# EAGLE design Doorbell (EAGLE 7.2.0)
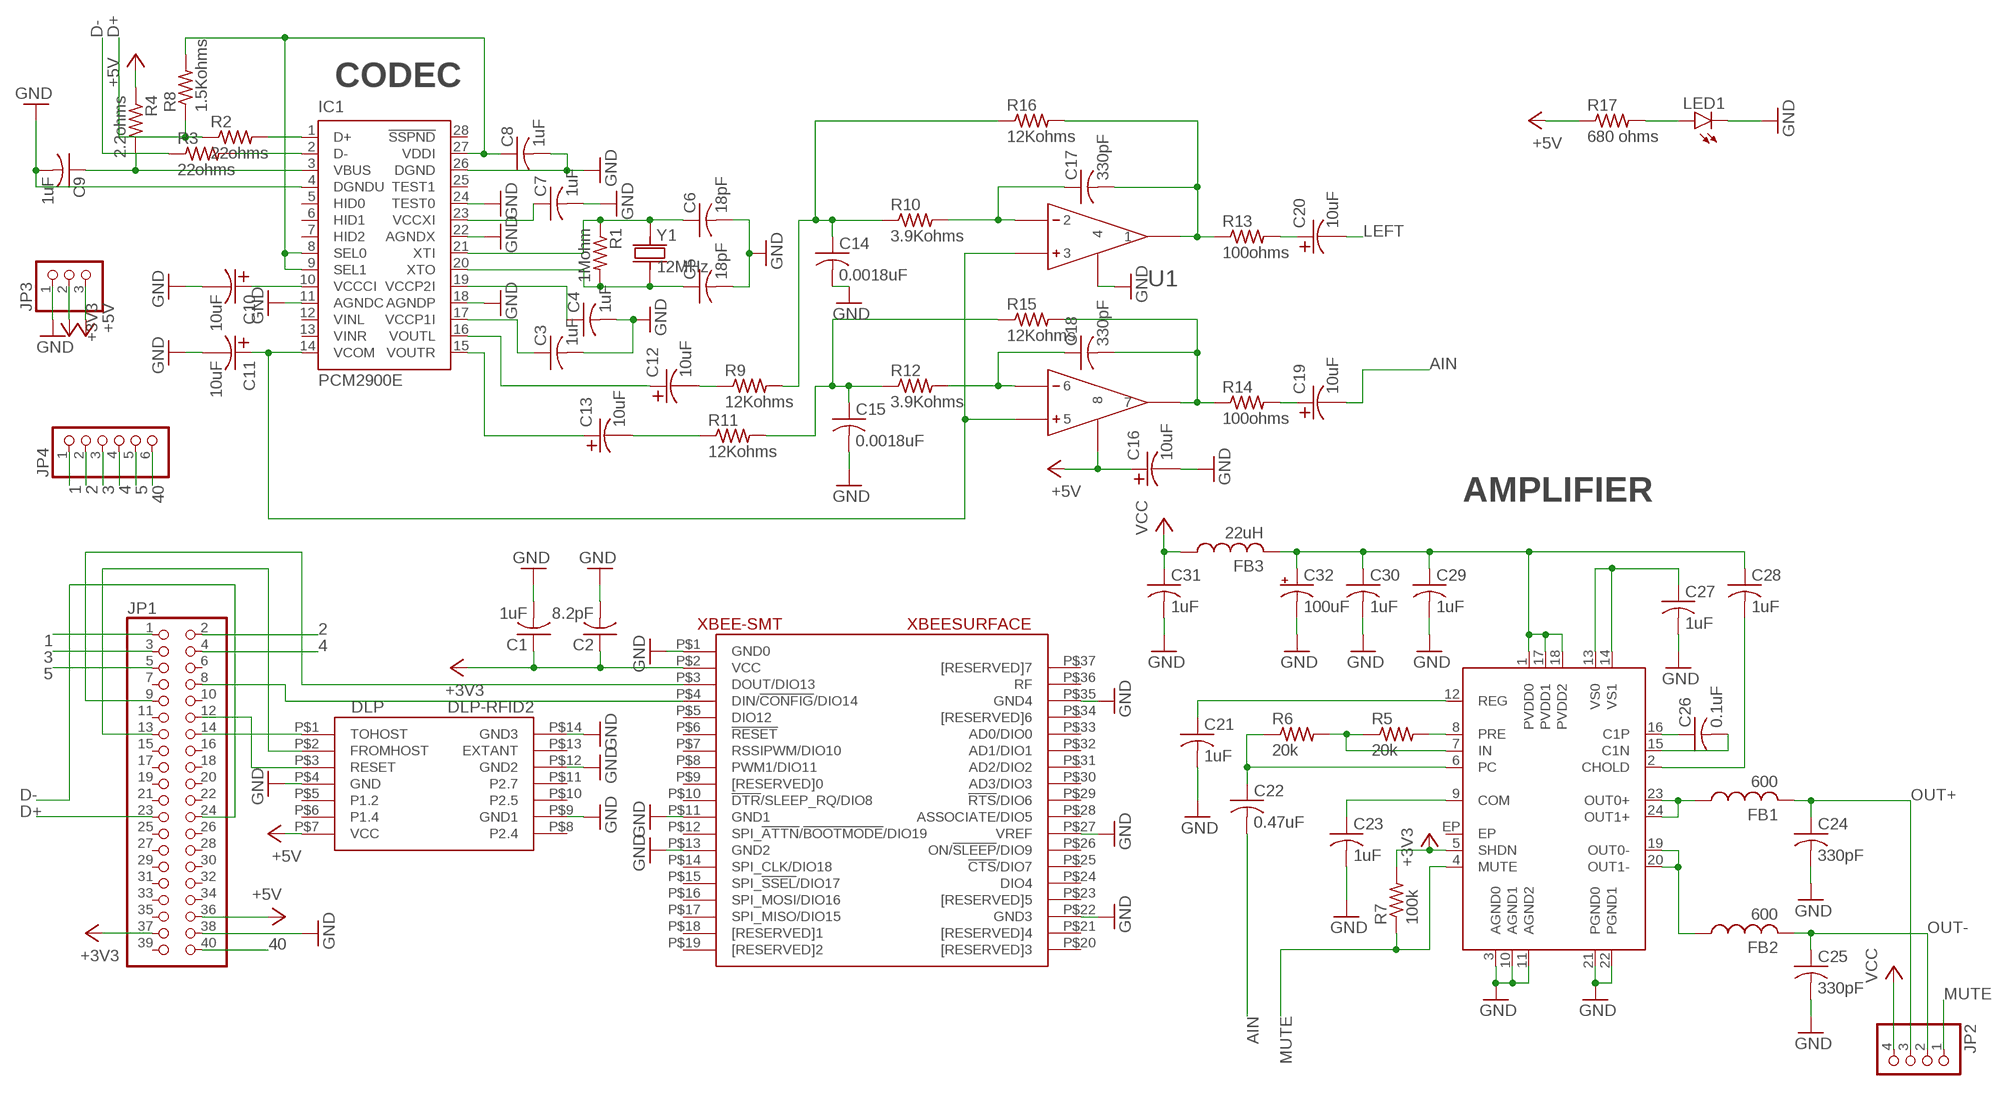
[diagram p0: schematic, sheet 1]

## Parts
C1  1uF  CAP0603  [0603_CAP]
C2  8.2pF  CAP0603  [0603_CAP]
C3  1uF  CAP0603  [0603_CAP]
C4  1uF  CAP0603  [0603_CAP]
C5  18pF  CAP0603  [0603_CAP]
C6  18pF  CAP0603  [0603_CAP]
C7  1uF  CAP0603  [0603_CAP]
C8  1uF  CAP0603  [0603_CAP]
C9  1uF  CAP0603  [0603_CAP]
C10  10uF  CAP-TANT  [1411_CAP]
C11  10uF  CAP-TANT  [1411_CAP]
C12  10uF  CAP-TANT  [1411_CAP]
C13  10uF  CAP-TANT  [1411_CAP]
C14  0.0018uF  CAP0603  [0603_CAP]
C15  0.0018uF  CAP0603  [0603_CAP]
C16  10uF  CAP-TANT  [1411_CAP]
C17  330pF  CAP0603  [0603_CAP]
C18  330pF  CAP0603  [0603_CAP]
C19  10uF  CAP-TANT  [1411_CAP]
C20  10uF  CAP-TANT  [1411_CAP]
C21  1uF  CAP0603  [0603_CAP]
C22  0.47uF  CAP0603  [0603_CAP]
C23  1uF  CAP0603  [0603_CAP]
C24  330pF  CAP0603  [0603_CAP]
C25  330pF  CAP0603  [0603_CAP]
C26  0.1uF  CAP0603  [0603_CAP]
C27  1uF  CAP0603  [0603_CAP]
C28  1uF  CAP0603  [0603_CAP]
C29  1uF  CAP0603  [0603_CAP]
C30  1uF  CAP0603  [0603_CAP]
C31  1uF  CAP0603  [0603_CAP]
C32  100uF  CAP_POLF  [F_CAP]
DLP  DLP-RFID2  [DLP-RFID2]
FB1  600  FB0805  [0805_FB]
FB2  600  FB0805  [0805_FB]
FB3  22uH  FB0805  [0805_FB]
IC1  PCM2900E  [SSOP28DB]
IC2  MAX9737  [TQFN24]
JP1  PINHD-2X20  [2X20]
JP2  PINHD-1X4  [1X04]
JP3  PINHD-1X3  [1X03]
JP4  PINHD-1X6  [1X06]
LED1  LED0603  [0603_LED]
R1  1Mohm  RESISTOR0603  [0603_RESISTOR]
R2  22ohms  RESISTOR0603  [0603_RESISTOR]
R3  22ohms  RESISTOR0603  [0603_RESISTOR]
R4  2.2ohms  RESISTOR0603  [0603_RESISTOR]
R5  20k  RESISTOR0603  [0603_RESISTOR]
R6  20k  RESISTOR0603  [0603_RESISTOR]
R7  100k  RESISTOR0603  [0603_RESISTOR]
R8  1.5Kohms  RESISTOR0603  [0603_RESISTOR]
R9  12Kohms  RESISTOR0603  [0603_RESISTOR]
R10  3.9Kohms  RESISTOR0603  [0603_RESISTOR]
R11  12Kohms  RESISTOR0603  [0603_RESISTOR]
R12  3.9Kohms  RESISTOR0603  [0603_RESISTOR]
R13  100ohms  RESISTOR0603  [0603_RESISTOR]
R14  100ohms  RESISTOR0603  [0603_RESISTOR]
R15  12Kohms  RESISTOR0603  [0603_RESISTOR]
R16  12Kohms  RESISTOR0603  [0603_RESISTOR]
R17  680 ohms  RESISTOR0603  [0603_RESISTOR]
U1  OP-AMP  [OPA2353UA]
XBEE-SMT  XBEESURFACE  [XBEESURFACE]
Y1  12MHz  CRYSTAL5X3  [CRYSTAL_5X3]

## Nets
1: JP1.1 JP4.1
2: JP1.2 JP4.2
3: JP1.3 JP4.3
4: JP1.4 JP4.4
5: JP1.5 JP4.5
40: JP1.40 JP4.6
+3V3: C1.1 C2.1 IC2.5(SHDN) JP1.37 JP3.2 R7.2 XBEE-SMT.P$2(VCC)
+5V: C16.P$1 DLP.P$7(VCC) JP1.36 JP3.3 R4.1 R17.1 U1.P$8
AIN: C19.P$2 C22.2
D+: JP1.23 R2.1 R8.1
D-: JP1.24 R3.1
GND: C1.2 C2.2 C3.2 C4.2 C5.2 C6.2 C7.2 C8.2 C9.2 C10.P$2 C11.P$2 C14.2 C15.2 C16.P$2 C21.2 C23.2 C24.2 C25.2 C27.2 C29.2 C30.2 C31.2 C32.- DLP.P$4(GND) DLP.P$9(GND1) DLP.P$12(GND2) DLP.P$14(GND3) IC1.4(DGNDU) IC1.11(AGNDC) IC1.18(AGNDP) IC1.22(AGNDX) IC1.24(TEST0) IC1.26(DGND) IC2.3(AGND0) IC2.10(AGND1) IC2.11(AGND2) IC2.21(PGND0) IC2.22(PGND1) JP1.38 JP3.1 LED1.C U1.P$4 XBEE-SMT.P$1(GND0) XBEE-SMT.P$11(GND1) XBEE-SMT.P$13(GND2) XBEE-SMT.P$22(GND3) XBEE-SMT.P$27(VREF) XBEE-SMT.P$35(GND4)
LEFT: C20.P$2
MUTE: IC2.4(MUTE) JP2.1 R7.1
N$1: DLP.P$1(TOHOST) JP1.14
N$2: IC2.8(PRE) R5.2
N$3: IC2.7(IN) R5.1 R6.2
N$4: DLP.P$3(RESET) JP1.12
N$5: DLP.P$2(FROMHOST) JP1.13
N$6: JP1.8 XBEE-SMT.P$4(DIN/!CONFIG!/DIO14)
N$7: JP1.9 XBEE-SMT.P$3(DOUT/DIO13)
N$8: C3.1 IC1.17(VCCP1I)
N$9: IC1.1(D+) R2.2
N$10: C22.1 IC2.6(PC) R6.1
N$11: C8.1 IC1.8(SEL0) IC1.9(SEL1) IC1.27(VDDI) R8.2
N$12: IC1.2(D-) R3.2
N$13: C21.1 IC2.12(REG)
N$15: C7.1 IC1.23(VCCXI)
N$16: C6.1 IC1.21(XTI) R1.1 Y1.1
N$17: C5.1 IC1.20(XTO) R1.2 Y1.2
N$18: C4.1 IC1.19(VCCP2I)
N$19: C12.P$2 R9.1
N$20: C13.P$2 R11.1
N$21: C17.1 R10.2 U1.P$2
N$22: C10.P$1 IC1.10(VCCCI)
N$23: C11.P$1 IC1.14(VCOM) U1.P$3 U1.P$5
N$24: C18.1 R12.2 U1.P$6
N$25: C12.P$1 IC1.16(VOUTL)
N$26: C13.P$1 IC1.15(VOUTR)
N$27: C14.1 R9.2 R10.1 R16.1
N$28: C15.1 R11.2 R12.1 R15.1
N$29: C17.2 R13.1 R16.2 U1.P$1
N$30: C18.2 R14.1 R15.2 U1.P$7
N$31: LED1.A R17.2
N$33: C20.P$1 R13.2
N$34: C19.P$1 R14.2
N$35: C9.1 IC1.3(VBUS) R4.2
N$37: C23.1 IC2.9(COM)
N$42: FB1.1 IC2.23(OUT0+) IC2.24(OUT1+)
N$44: FB2.1 IC2.19(OUT0-) IC2.20(OUT1-)
N$48: C26.1 IC2.16(C1P)
N$49: C26.2 IC2.15(C1N)
N$50: C28.2 IC2.2(CHOLD)
N$51: C28.1 C29.1 C30.1 C32.+ FB3.2 IC2.1(PVDD0) IC2.17(PVDD1) IC2.18(PVDD2)
N$52: C27.1 IC2.13(VS0) IC2.14(VS1)
OUT+: C24.1 FB1.2 JP2.3
OUT-: C25.1 FB2.2 JP2.2
VCC: C31.1 FB3.1 JP2.4
Unconnected: DLP.P$5(P1.2) DLP.P$6(P1.4) DLP.P$8(P2.4) DLP.P$10(P2.5) DLP.P$11(P2.7) DLP.P$13(EXTANT) IC1.5(HID0) IC1.6(HID1) IC1.7(HID2) IC1.12(VINL) IC1.13(VINR) IC1.25(TEST1) IC1.28(!SSPND) IC2.EP JP1.6 JP1.7 JP1.10 JP1.11 JP1.15 JP1.16 JP1.17 JP1.18 JP1.19 JP1.20 JP1.21 JP1.22 JP1.25 JP1.26 JP1.27 JP1.28 JP1.29 JP1.30 JP1.31 JP1.32 JP1.33 JP1.34 JP1.35 JP1.39 XBEE-SMT.P$5(DIO12) XBEE-SMT.P$6(!RESET!) XBEE-SMT.P$7(RSSIPWM/DIO10) XBEE-SMT.P$8(PWM1/DIO11) XBEE-SMT.P$9([RESERVED]0) XBEE-SMT.P$10(!DTR!/SLEEP_RQ/DIO8) XBEE-SMT.P$12(SPI_!ATTN!/!BOOTMODE!/DIO19) XBEE-SMT.P$14(SPI_CLK/DIO18) XBEE-SMT.P$15(SPI_!SSEL!/DIO17) XBEE-SMT.P$16(SPI_MOSI/DIO16) XBEE-SMT.P$17(SPI_MISO/DIO15) XBEE-SMT.P$18([RESERVED]1) XBEE-SMT.P$19([RESERVED]2) XBEE-SMT.P$20([RESERVED]3) XBEE-SMT.P$21([RESERVED]4) XBEE-SMT.P$23([RESERVED]5) XBEE-SMT.P$24(DIO4) XBEE-SMT.P$25(!CTS!/DIO7) XBEE-SMT.P$26(ON/!SLEEP!/DIO9) XBEE-SMT.P$28(ASSOCIATE/DIO5) XBEE-SMT.P$29(!RTS!/DIO6) XBEE-SMT.P$30(AD3/DIO3) XBEE-SMT.P$31(AD2/DIO2) XBEE-SMT.P$32(AD1/DIO1) XBEE-SMT.P$33(AD0/DIO0) XBEE-SMT.P$34([RESERVED]6) XBEE-SMT.P$36(RF) XBEE-SMT.P$37([RESERVED]7)

## Notes on the sheet
- CODEC
- AMPLIFIER

## Library data of the parts
C1-C9 C14 C15 C17 C18 C21-C31 = jkf:CAP
C10-C13 C16 C19 C20 = 1parts:CAP-TANT
C32 = jkf:CAP_POL
DLP = 1parts:DLP-RFID2
FB1-FB3 = jkf:FB
IC1 = texas:PCM29*: STEREO AUDIO CODEC WITH USB INTERFACE SINGLE-ENDED ANALOG INPUT/OUTPUT AND S/PDIF; MF: TEXAS INSTRUMENTS; MPN: PCM2900E; OC_FARNELL: 1207086; OC_NEWARK: 75C5376
IC2 = jkf:MAX9737; DIGIKEY#: MAX9737ETG+TCT-ND; MANF: Maxim; MANF#: MAX9737ETG+T
JP1 = pinhead:PINHD-2X20: PIN HEADER
JP2 = pinhead:PINHD-1X4: PIN HEADER
JP3 = pinhead:PINHD-1X3: PIN HEADER
JP4 = pinhead:PINHD-1X6: PIN HEADER
LED1 = jkf:LED; DIGIKEY#: 516-2493-1-ND; MANF: Avago Technologies; MANF#: HSMG-C191
R1-R17 = jkf:RESISTOR
U1 = 1parts:OP-AMP: Datasheet: http://www.ti.com/lit/ds/symlink/opa2353.pdf; DIGI-KEY: 296-26259-1-ND
XBEE-SMT = 1parts:XBEESURFACE: Data Sheet: http://ftp1.digi.com/support/documentation/90002002_P.pdf
Y1 = jkf:CRYSTAL

## Board
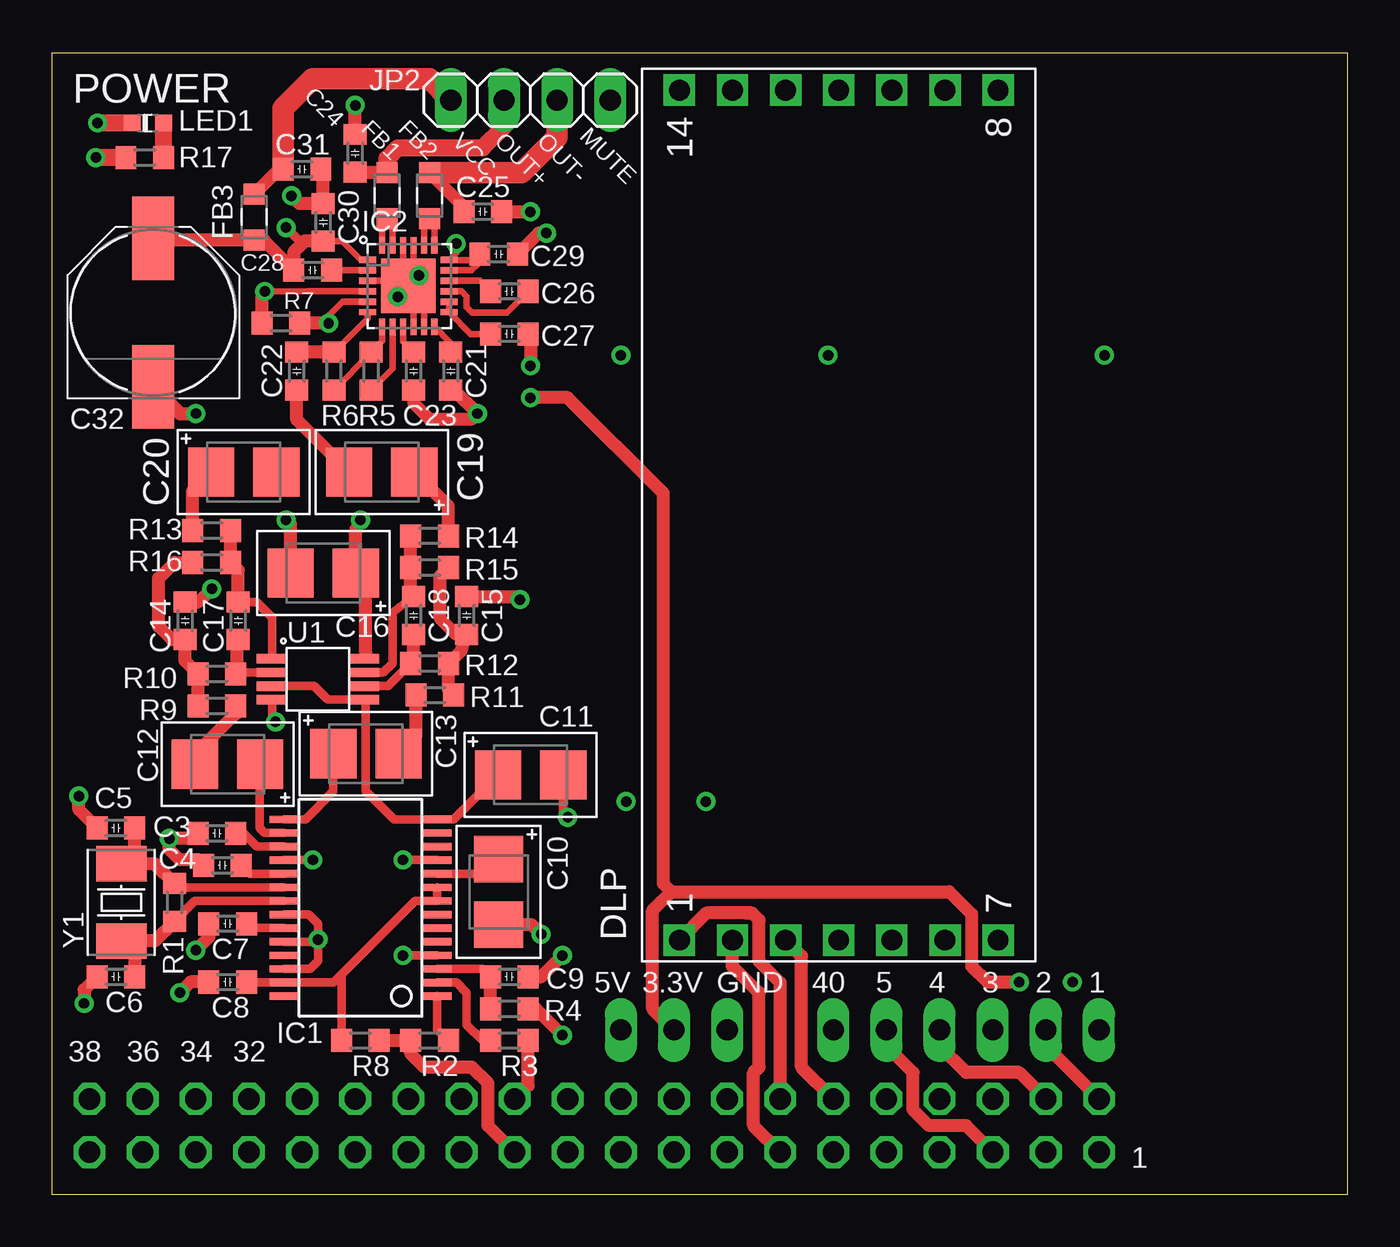
[diagram p1: board, top side]
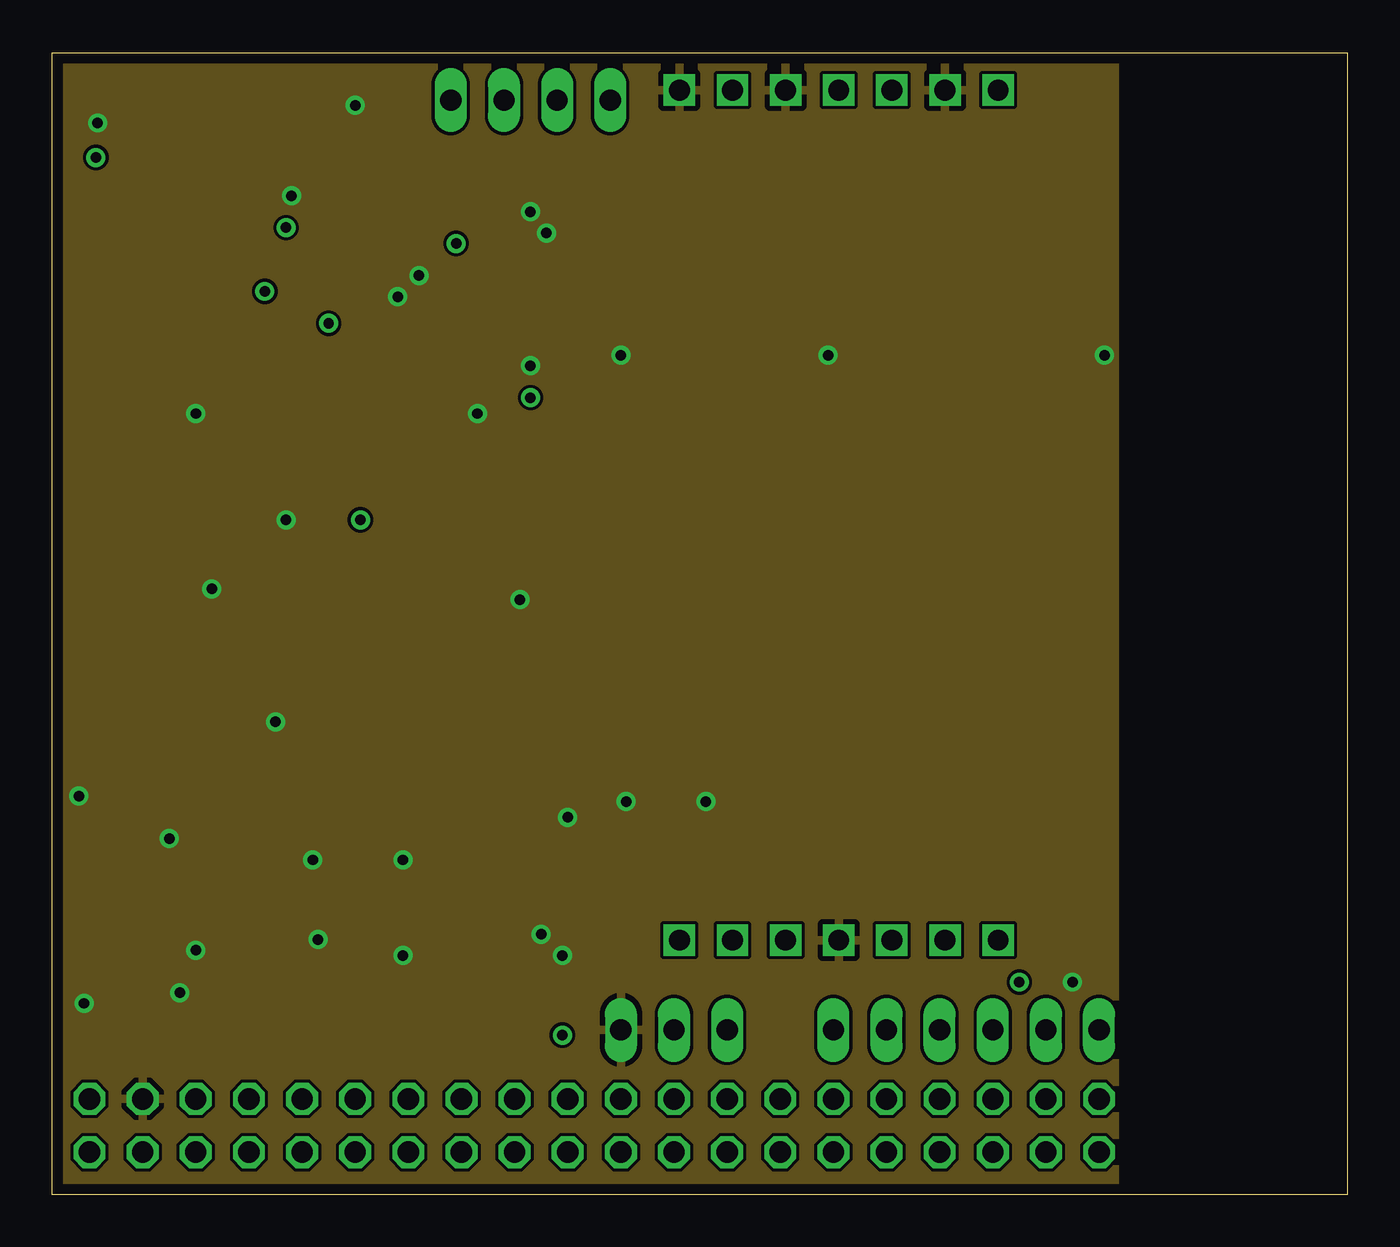
[diagram p2: board, inner layer GND]
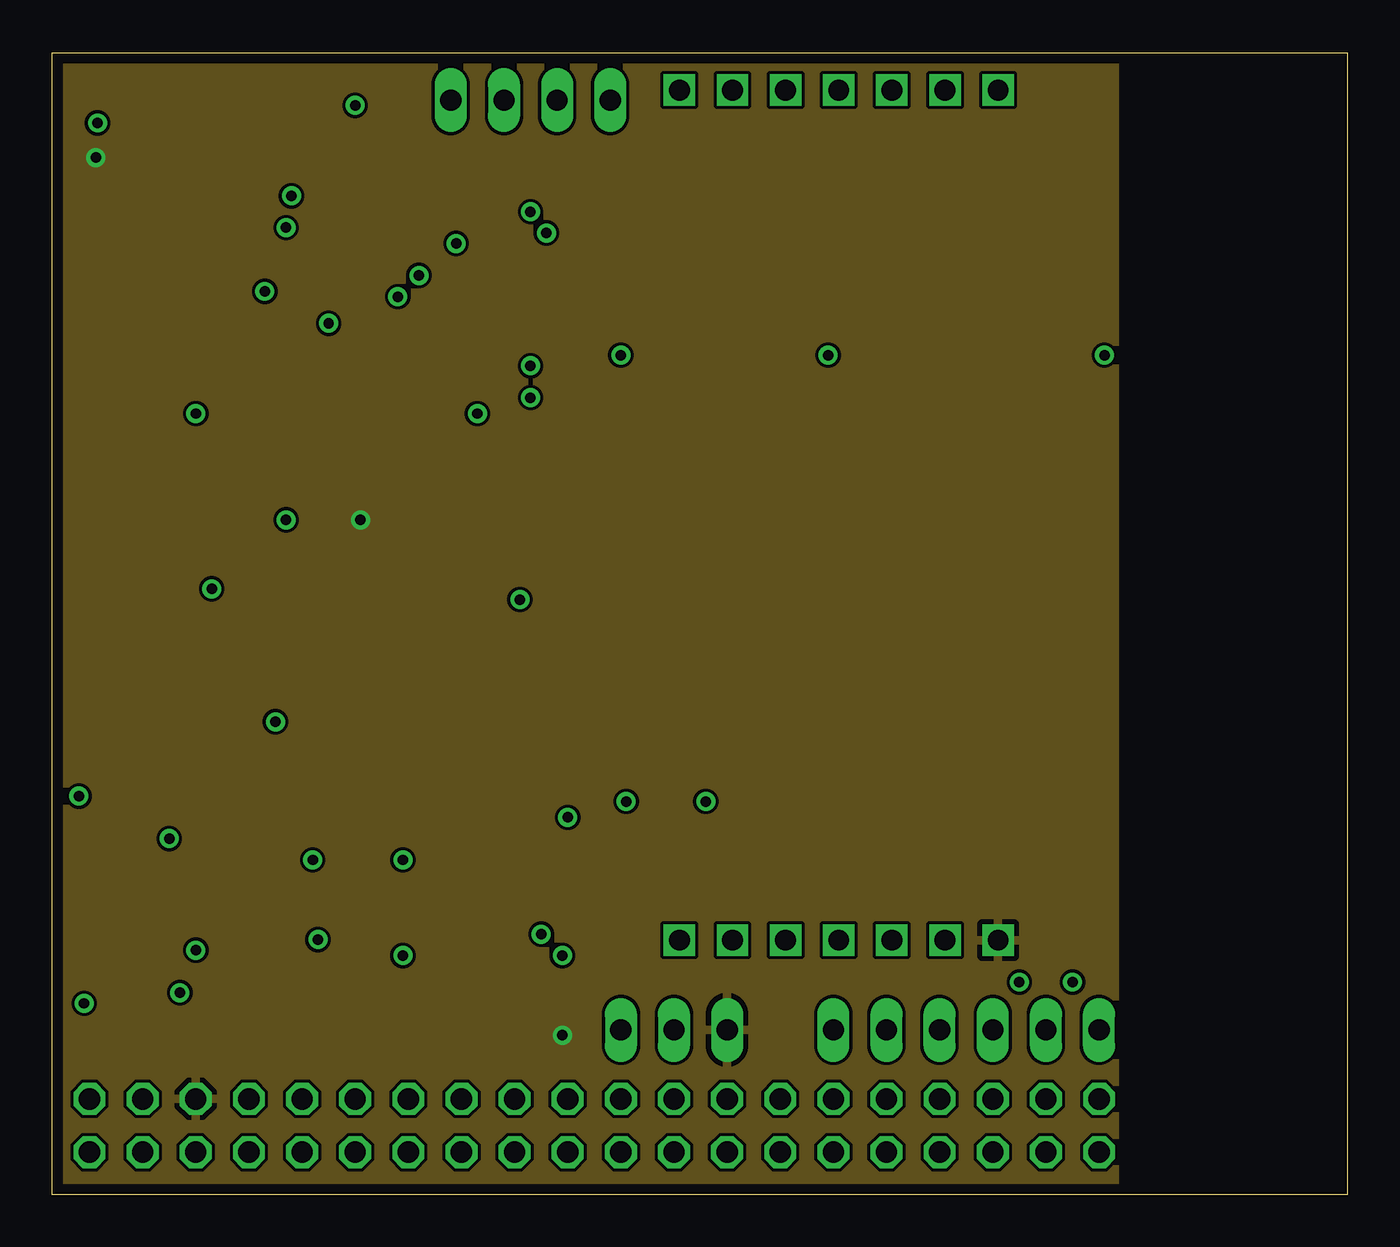
[diagram p3: board, inner layer +5V]
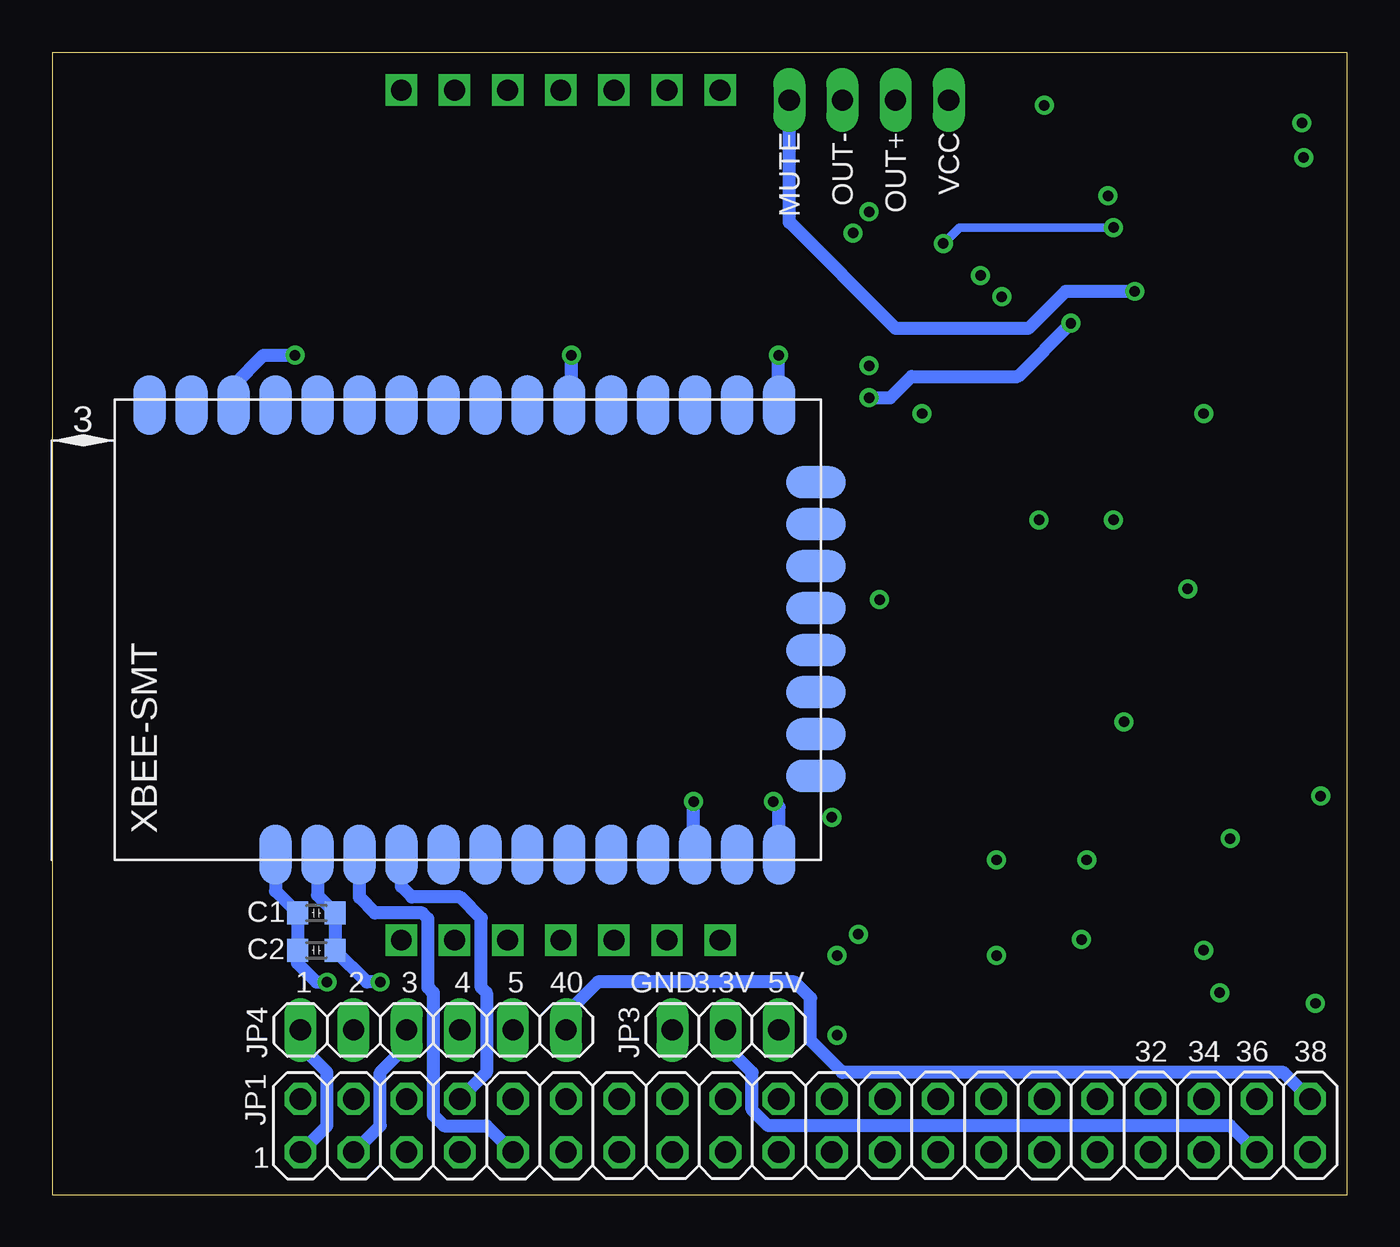
[diagram p4: board, bottom side, seen from below]

Size 61.9 x 54.59 mm. Coordinates in mm from the lower left corner, seen from the top.
Outline: 0,0 0,54.59 61.9,54.59 61.9,0 0,0
Copper layers (1+2*15+16): Top 0.0178mm / dielectric 12mil / GND 0.0356mm / dielectric 28mil / +5V 0.0356mm / dielectric 12mil / Bottom 0.0178mm
Design rules "SSC-EAGLE-4Lyr_v1.0.0.3": minimum track width 6mil, minimum drill 8mil, track to track 6mil, track to pad 6mil, pad to pad 6mil, via to via 6mil, smd to smd 6mil, copper to edge 20mil, drill to drill 16mil, minimum pad ring 8mil, minimum via ring 8mil, stop-mask expansion 3mil, vias tented up to drill 0mil, thermal gap 10mil

### Footprints (pad centres in the part's own frame; a part is rotated, then mirrored left to right if it is on the bottom)
0603_CAP = smd 1 x 1.1: 1 -0.9,0; 2 0.9,0
1411_CAP = smd 2.21 x 2.35: P$1 -1.555,0; P$2 1.565,0
F_CAP = smd 4 x 2: + 3.55,0; - -3.55,0
DLP-RFID2 = drill 1 square: P$1 -20.32,7.62; P$2 -20.32,5.08; P$3 -20.32,2.54; P$4 -20.32,0; P$5 -20.32,-2.54; P$6 -20.32,-5.08; P$7 -20.32,-7.62; P$8 20.32,-7.62; P$9 20.32,-5.08; P$10 20.32,-2.54; P$11 20.32,0; P$12 20.32,2.54; P$13 20.32,5.08; P$14 20.32,7.62
0805_FB = smd 1 x 1: 1 -1.1,0; 2 1.1,0
SSOP28DB = smd 0.348 x 1.397: 1 -4.225,-3.656; 2 -3.575,-3.656; 3 -2.925,-3.656; 4 -2.275,-3.656; 5 -1.625,-3.656; 6 -0.975,-3.656; 7 -0.325,-3.656; 8 0.325,-3.656; 9 0.975,-3.656; 10 1.625,-3.656; 11 2.275,-3.656; 12 2.925,-3.656; 13 3.575,-3.656; 14 4.225,-3.656; 15 4.225,3.656; 16 3.575,3.656; 17 2.925,3.656; 18 2.275,3.656; 19 1.625,3.656; 20 0.975,3.656; 21 0.325,3.656; 22 -0.325,3.656; 23 -0.975,3.656; 24 -1.625,3.656; 25 -2.275,3.656; 26 -2.925,3.656; 27 -3.575,3.656; 28 -4.225,3.656
TQFN24 = smd 0.8 x 0.3: 1 -1.95,1.25; 2 -1.95,0.75; 3 -1.95,0.25; 4 -1.95,-0.25; 5 -1.95,-0.75; 6 -1.95,-1.25; 13 1.95,-1.25; 14 1.95,-0.75; 15 1.95,-0.25; 16 1.95,0.25; 17 1.95,0.75; 18 1.95,1.25 | smd 0.3 x 0.8: 7 -1.25,-1.95; 8 -0.75,-1.95; 9 -0.25,-1.95; 10 0.25,-1.95; 11 0.75,-1.95; 12 1.25,-1.95; 19 1.25,1.95; 20 0.75,1.95; 21 0.25,1.95; 22 -0.25,1.95; 23 -0.75,1.95; 24 -1.25,1.95 | smd 2.6 x 2.6: EP 0,0
2X20 = drill 1.016 octagon: 1 -24.13,-1.27; 2 -24.13,1.27; 3 -21.59,-1.27; 4 -21.59,1.27; 5 -19.05,-1.27; 6 -19.05,1.27; 7 -16.51,-1.27; 8 -16.51,1.27; 9 -13.97,-1.27; 10 -13.97,1.27; 11 -11.43,-1.27; 12 -11.43,1.27; 13 -8.89,-1.27; 14 -8.89,1.27; 15 -6.35,-1.27; 16 -6.35,1.27; 17 -3.81,-1.27; 18 -3.81,1.27; 19 -1.27,-1.27; 20 -1.27,1.27; 21 1.27,-1.27; 22 1.27,1.27; 23 3.81,-1.27; 24 3.81,1.27; 25 6.35,-1.27; 26 6.35,1.27; 27 8.89,-1.27; 28 8.89,1.27; 29 11.43,-1.27; 30 11.43,1.27; 31 13.97,-1.27; 32 13.97,1.27; 33 16.51,-1.27; 34 16.51,1.27; 35 19.05,-1.27; 36 19.05,1.27; 37 21.59,-1.27; 38 21.59,1.27; 39 24.13,-1.27; 40 24.13,1.27
1X04 = drill 1.016 long: 1 -3.81,0; 2 -1.27,0; 3 1.27,0; 4 3.81,0
1X03 = drill 1.016 long: 1 -2.54,0; 2 0,0; 3 2.54,0
1X06 = drill 1.016 long: 1 -6.35,0; 2 -3.81,0; 3 -1.27,0; 4 1.27,0; 5 3.81,0; 6 6.35,0
0603_LED = smd 0.8 x 0.8: A 0.75,0; C -0.75,0
0603_RESISTOR = smd 1 x 1.1: 1 -0.9,0; 2 0.9,0
OPA2353UA = smd 0.45 x 1.45: P$1 -0.975,-2.2; P$2 -0.325,-2.2; P$3 0.325,-2.2; P$4 0.975,-2.2; P$5 0.975,2.2; P$6 0.325,2.2; P$7 -0.325,2.2; P$8 -0.975,2.2
XBEESURFACE = smd 2.845 x 1.524: P$1 -11.176,9.576; P$2 -11.176,7.569; P$3 -11.176,5.563; P$4 -11.176,3.556; P$5 -11.176,1.549; P$6 -11.176,-0.457; P$7 -11.176,-2.464; P$8 -11.176,-4.47; P$9 -11.176,-6.477; P$10 -11.176,-8.484; P$11 -11.176,-10.49; P$12 -11.176,-12.497; P$13 -11.176,-14.503; P$22 10.312,-14.503; P$23 10.312,-12.497; P$24 10.312,-10.49; P$25 10.312,-8.484; P$26 10.312,-6.477; P$27 10.312,-4.47; P$28 10.312,-2.464; P$29 10.312,-0.457; P$30 10.312,1.549; P$31 10.312,3.556; P$32 10.312,5.563; P$33 10.312,7.569; P$34 10.312,9.576; P$35 10.312,11.582; P$36 10.312,13.589; P$37 10.312,15.596 | smd 1.524 x 2.845: P$14 -7.417,-16.256; P$15 -5.41,-16.256; P$16 -3.404,-16.256; P$17 -1.397,-16.256; P$18 0.61,-16.256; P$19 2.616,-16.256; P$20 4.623,-16.256; P$21 6.629,-16.256
CRYSTAL_5X3 = smd 1.7 x 2.4: 1 -1.85,0; 2 1.85,0

### Placement (x,y rotation side)
C1  49.28,13.46 180 bottom
C2  49.28,11.68 180 bottom
C3  7.88,17.27 180 top
C4  8.13,15.75 180 top
C5  3.05,17.53 180 top
C6  3.05,10.41 180 top
C7  8.38,12.95 180 top
C8  8.38,10.16 180 top
C9  21.85,10.41 0 top
C10  21.34,14.48 270 top
C11  22.86,20.07 0 top
C12  8.38,20.57 180 top
C13  14.99,21.08 0 top
C14  6.35,27.43 90 top
C15  19.81,27.69 90 top
C16  12.96,29.72 180 top
C17  8.89,27.43 90 top
C18  17.27,27.69 90 top
C19  15.75,34.54 180 top
C20  9.14,34.54 0 top
C21  19.05,39.37 270 top
C22  11.68,39.37 270 top
C23  17.27,39.37 270 top
C24  14.48,49.78 90 top
C25  20.58,46.99 0 top
C26  21.85,43.18 0 top
C27  21.85,41.15 0 top
C28  12.45,44.2 0 top
C29  21.34,44.96 0 top
C30  12.96,46.48 90 top
C31  11.94,49.02 0 top
C32  4.83,42.16 90 top
DLP  37.59,32.49 90 top
FB1  16,47.75 90 top
FB2  18.04,47.75 90 top
FB3  9.65,46.74 270 top
IC1  14.73,13.72 90 top
IC2  17.02,43.43 0 top
JP1  25.91,3.3 0 bottom
JP2  22.86,52.32 180 top
JP3  29.72,7.87 180 bottom
JP4  43.69,7.87 0 bottom
LED1  4.57,51.23 0 top
R1  5.84,13.97 90 top
R2  18.04,7.37 0 top
R3  21.85,7.37 180 top
R4  21.85,8.89 180 top
R5  15.24,39.37 270 top
R6  13.46,39.37 270 top
R7  10.92,41.66 0 top
R8  14.73,7.37 180 top
R9  7.88,23.37 180 top
R10  7.88,24.89 0 top
R11  18.29,23.88 0 top
R12  18.04,25.4 180 top
R13  7.62,31.75 180 top
R14  18.04,31.5 0 top
R15  18.04,29.97 180 top
R16  7.62,30.23 0 top
R17  4.42,49.58 0 top
U1  12.7,24.64 270 top
XBEE-SMT  41.66,27.43 90 bottom
Y1  3.3,13.97 90 top

### Tracks (layer width: path | path; a pad name or v marks a point on that pad's centre or on a via)
1
  Bottom 0.61: JP1.1 48.77,3.3 48.77,5.84 50.04,7.11 JP4.1
2
  Top 0.61: JP1.2 47.5,7.11 JP4.2
3
  Bottom 0.61: JP1.3 46.23,3.3 46.23,5.84 44.96,7.11 JP4.3
4
  Top 0.61: JP1.4 46.23,5.84 43.69,5.84 42.42,7.11 JP4.4
5
  Top 0.61: JP1.5 43.69,3.3 41.91,3.3 41.15,4.06 41.15,5.84 39.88,7.11 JP4.5
40
  Bottom 0.61: JP1.40 3.05,5.84 24.13,5.84 25.66,7.37 25.66,9.4 26.42,10.16 35.81,10.16 37.34,8.64 JP4.6
+3V3  (via drill 0.5)
  Top 0.305: IC2.5 13.87,42.68 13.21,42.03 v13.21,41.66
  Top 0.61: JP3.2 28.7,8.89 28.7,13.59 29.59,14.48 | 29.59,14.48 42.88,14.48 43.94,13.41 43.94,10.92 44.7,10.16 v46.23,10.16 | v22.86,38.1 24.64,38.1 29.21,33.53 29.21,14.86 29.59,14.48 | v13.21,41.66 R7.2
  Bottom 0.61: XBEE-SMT.P$2 49.23,14.31 C1.1 C2.1 46.85,10.16 v46.23,10.16 | JP1.37 5.59,3.3 27.69,3.3 28.45,4.06 28.45,5.84 29.72,7.11 JP3.2 | v22.86,38.1 21.85,38.1 20.83,39.12 15.75,39.12 v13.21,41.66
+5V  (via drill 0.5)
  Top 0.406: U1.P$8 14.99,25.7 14.99,25.91
  Top 0.61: R4.1 23.12,8.89 v24.39,7.62 | v14.73,32.26 14.51,31.72 C16.P$1 14.99,29.24 14.99,25.91
  Top 0.813: R17.1 v2.08,49.58
  pour +5V: 50.8,54.61 50.8,0 0,0 0,54.61
AIN
  Top 0.61: C19.P$2 11.68,37.04 C22.2
D+
  Top 0.61: JP1.23 20.83,3.3 20.83,5.33 20.07,6.1 17.78,6.1 17.14,6.74 R2.1 R8.1
D-
  Top 0.61: JP1.24 22.75,5.22 R3.1
GND  (via drill 0.5)
  Top 0.305: IC2.21 17.27,44.2 v17.53,43.94 17.77,43.7 IC2.11 | IC2.10 17.27,42.17 v16.51,42.93 | IC2.3 15.75,43.68 v16.51,42.93 | IC2.22 16.77,43.18 v16.51,42.93
  Top 0.406: IC1.24 12.6,12.09 v12.7,12.19 | IC1.22 12.26,13.39 12.7,12.95 v12.7,12.19 | IC1.26 12.32,10.79 12.7,11.18 v12.7,12.19 | IC1.4 16.78,11.44 v16.77,11.43 | IC1.18 12.44,15.99 v12.45,16 | IC1.11 16.78,15.99 v16.77,16 | C9.2 23.12,10.41 | C11.P$2 24.43,18.25 v24.64,18.03 | U1.P$4 10.5,22.77 v10.67,22.61
  Top 0.61: C31.2 12.96,48.91 C30.2 11.8,47.38 v11.43,47.75 | 23.12,10.41 23.37,10.41 v24.39,11.43 | C10.P$2 22.9,12.91 v23.37,12.45 | C5.2 1.27,18.4 v1.27,19.05 | C6.2 1.52,9.79 v1.52,9.14 | C8.2 6.61,10.16 v6.1,9.65 | C7.2 7.48,12.31 v6.86,11.68 | C14.2 7,28.33 v7.62,28.96 | C15.2 22.21,28.59 v22.35,28.45 | C3.2 6.72,17.02 v5.59,17.02 5.59,16.51 6.1,16 6.98,16 C4.2 | C32.- 6.1,37.34 v6.86,37.34 | C24.2 v14.48,52.07 | C25.2 v22.86,46.99 | C29.2 23.25,45.97 v23.62,45.97 | C27.2 22.86,41.03 v22.86,39.62 | C16.P$2 11.39,32.05 v11.18,32.26 | C21.2 19.19,38.47 v20.32,37.34 20.07,37.08 18.04,37.08 17.27,37.85 C23.2
  Top 0.813: LED1.C v2.16,51.23
  Bottom 0.61: XBEE-SMT.P$1 51.23,14.52 C1.2 C2.2 50.18,11.06 49.28,10.16 v48.77,10.16 | XBEE-SMT.P$35 53.24,38.71 51.82,40.13 v50.29,40.13 | XBEE-SMT.P$27 37.09,37.85 v37.09,40.13 | XBEE-SMT.P$22 27.18,37.77 v27.18,40.13 | XBEE-SMT.P$11 31.24,16.33 v31.24,18.8 | XBEE-SMT.P$13 27.15,18.52 v27.43,18.8
  pour GND: 50.8,54.61 50.8,0 0,0 0,54.61
MUTE  (via drill 0.5)
  Top 0.305: IC2.4 12.2,43.18 v10.16,43.18
  Top 0.61: R7.1 10.02,43.04 v10.16,43.18
  Bottom 0.61: v10.16,43.18 13.46,43.18 15.24,41.4 21.59,41.4 26.67,46.48 JP2.1
N$1
  Top 0.61: DLP.P$1 31.27,13.46 33.17,13.46 33.27,13.46 33.45,13.46 33.78,13.13 33.78,11.15 34.8,10.13 JP1.14
N$2
  Top 0.305: IC2.8 16.27,39.5 R5.2
N$3
  Top 0.305: IC2.7 15.77,40.8 R5.1 15.24,40.25 R6.2
N$4
  Top 0.61: JP1.12 35.81,6.1 35.81,11.4 DLP.P$3
N$5
  Top 0.61: JP1.13 33.53,3.3 33.53,5.84 33.78,6.1 33.78,9.65 32.51,10.92 DLP.P$2
N$6
  Bottom 0.61: JP1.8 41.15,5.84 41.15,9.65 41.4,9.91 41.4,13.21 42.42,14.22 44.7,14.22 45.21,14.73 XBEE-SMT.P$4
N$7
  Bottom 0.61: JP1.9 41.15,3.3 43.18,3.3 43.69,3.81 43.69,9.65 43.94,9.91 43.94,13.18 44.22,13.46 46.48,13.46 47.22,14.2 XBEE-SMT.P$3
N$8
  Top 0.406: IC1.17 9.78,16.64 9.14,17.27 C3.1
N$9
  Top 0.406: IC1.1 18.39,7.91 R2.2
N$10
  Top 0.305: IC2.6 15.07,41.88 R6.1
  Top 0.61: R6.1 C22.1
N$11
  Top 0.406: IC1.9 IC1.8 17.34,14.04 13.83,10.53 | 13.83,10.53 R8.2 | 13.83,10.53 13.44,10.14 IC1.27 9.3,10.14 C8.1
N$12
  Top 0.406: IC1.2 19.32,10.14 19.81,9.65 19.81,8.13 20.58,7.37 R3.2
N$13
  Top 0.305: IC2.12 19.05,40.7 C21.1
N$15
  Top 0.406: IC1.23 9.5,12.74 C7.1
N$16
  Top 0.406: IC1.21 6.81,14.04 R1.1
  Top 0.61: R1.1 4.89,12.12 Y1.1 3.95,11.47 C6.1
N$17
  Top 0.406: IC1.20 6.02,14.69 R1.2
  Top 0.61: R1.2 4.89,15.82 Y1.2 3.95,16.47 C5.1
N$18
  Top 0.406: IC1.19 9.44,15.34 C4.1
N$19
  Top 0.61: C12.P$2 6.82,21.04 8.77,23 R9.1
N$20
  Top 0.61: C13.P$2 17.39,21.92 R11.1
N$21
  Top 0.406: U1.P$2 8.85,24.96 R10.2
  Top 0.61: 8.85,24.96 8.85,26.49 C17.1
N$22
  Top 0.406: IC1.10 20.64,15.34 C10.P$1
N$23
  Top 0.406: C11.P$1 19.18,17.94 IC1.14 16.35,17.94 14.99,19.3 14.99,23.58 U1.P$5 13.17,23.66 12.52,24.31 U1.P$3
N$24
  Top 0.406: U1.P$6 16.05,24.31 R12.2
  Top 0.61: R12.2 17.27,25.54 C18.1
N$25
  Top 0.406: IC1.16 10.14,17.29 9.91,17.53 9.91,20.54 C12.P$1
N$26
  Top 0.406: IC1.15 12.1,17.94 13.43,19.27 C13.P$1
N$27
  Top 0.61: R9.2 R10.1 6.35,25.52 C14.1 5.73,26.53 5.08,27.18 5.08,29.46 5.84,30.23 R16.1
N$28
  Top 0.61: R11.2 18.94,24.13 R12.1 19.56,26.02 C15.1 19.3,26.79 18.54,27.55 18.54,29.58 R15.1
N$29
  Top 0.406: U1.P$1 10.5,27.6 9.77,28.33 C17.2
  Top 0.61: R13.1 R16.2 8.89,29.86 C17.2
N$30
  Top 0.406: U1.P$7 15.82,24.96 16.26,25.4 16.26,27.82 C18.2
  Top 0.61: R14.1 R15.2 17.14,28.72 C18.2
N$31
  Top 0.813: R17.2 LED1.A
N$33
  Top 0.61: R13.2 6.72,33.67 C20.P$1
N$34
  Top 0.61: R14.2 18.94,32.91 C19.P$1
N$35
  Top 0.406: IC1.3 20.57,10.79 C9.1
  Top 0.61: R4.2 C9.1
N$37
  Top 0.305: IC2.9 16.77,40.77 C23.1
N$42
  Top 0.305: IC2.23 16.27,46.13 FB1.1 15.77,46.16 IC2.24
N$44
  Top 0.305: IC2.20 17.77,46.13 FB2.1 18.27,46.16 IC2.19
N$48
  Top 0.305: IC2.16 20.44,43.68 C26.1
N$49
  Top 0.305: IC2.15 19.55,43.18 19.81,42.93 19.81,42.42 20.07,42.16 21.73,42.16 C26.2
N$50
  Top 0.305: IC2.2 13.36,44.18 C28.2
N$51  (via drill 0.5)
  Top 0.305: IC2.17 20.05,44.18 20.44,44.57 C29.1 20.16,44.68 IC2.18 19.3,45.02 v19.3,45.47 | IC2.1 14.75,44.68 13.85,45.58 C30.1
  Top 0.406: v11.18,46.23 11.94,45.47
  Top 0.61: C30.1 12.05,45.58 11.94,45.47 11.55,45.07 C28.1 10.11,45.64 FB3.2 4.91,45.64 C32.+
  Bottom 0.406: v19.3,45.47 18.54,46.23 v11.18,46.23
N$52
  Top 0.305: C27.1 20.01,41.15 IC2.13 IC2.14
OUT+
  Top 0.61: FB1.2 14.51,48.85 C24.1
  Top 0.813: FB1.2 16,49.53 16.51,50.04 20.58,50.04 21.59,51.05 JP2.3
OUT-
  Top 0.61: C25.1 19.68,47.21 FB2.2
  Top 1.016: FB2.2 22.44,48.85 24.13,50.55 JP2.2
VCC
  Top 0.61: C31.1 10.84,49.02 FB3.1
  Top 1.016: C31.1 11.04,51.93 12.45,53.34 18.04,53.34 JP2.4

### Text on the board
tNames: POWER | MUTE | VCC | OUT+ | OUT- | 5V | 3.3V | GND | 40 | 5 | 4 | 3 | 2 | 1 | 38 | 36 | 34 | 32 | 1
bNames: VCC | OUT+ | OUT- | MUTE | 5V | 3.3V | GND | 40 | 5 | 4 | 3 | 2 | 1 | 38 | 36 | 34 | 32 | 1